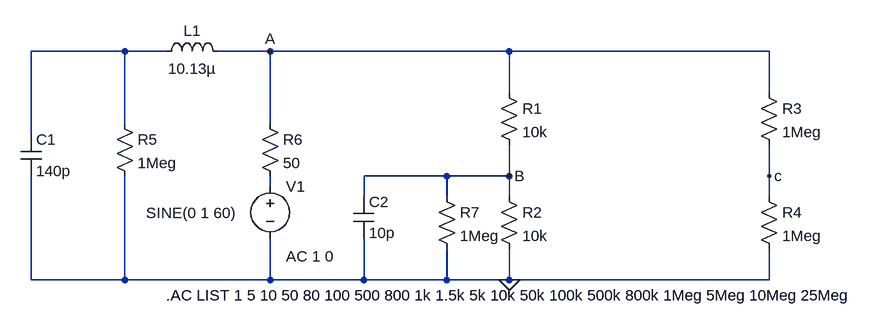
[diagram p0: schematic LAB0_Analoga2_Barridofrecuencias.asc]
LAB0_Analoga2_Barridofrecuencias.asc, the LTspice schematic file:
Version 4
SHEET 1 880 680
WIRE -480 48 -624 48
WIRE -416 48 -480 48
WIRE -256 48 -336 48
WIRE 112 48 -256 48
WIRE 512 48 112 48
WIRE 112 112 112 48
WIRE 512 112 512 48
WIRE -480 160 -480 48
WIRE -256 160 -256 48
WIRE -624 176 -624 48
WIRE 16 240 -112 240
WIRE 112 240 112 192
WIRE 112 240 16 240
WIRE 512 240 512 192
WIRE -256 256 -256 240
WIRE -112 272 -112 240
WIRE 16 272 16 240
WIRE 112 272 112 240
WIRE 512 272 512 240
WIRE -624 400 -624 240
WIRE -480 400 -480 240
WIRE -480 400 -624 400
WIRE -256 400 -256 336
WIRE -256 400 -480 400
WIRE -112 400 -112 336
WIRE -112 400 -256 400
WIRE 16 400 16 352
WIRE 16 400 -112 400
WIRE 112 400 112 352
WIRE 112 400 16 400
WIRE 512 400 512 352
WIRE 512 400 112 400
FLAG 112 400 0
FLAG 112 240 B
FLAG -256 48 A
FLAG 512 240 c
SYMBOL res 96 96 R0
SYMATTR InstName R1
SYMATTR Value 10k
SYMBOL res 96 256 R0
SYMATTR InstName R2
SYMATTR Value 10k
SYMBOL res 496 96 R0
SYMATTR InstName R3
SYMATTR Value 1Meg
SYMBOL res 496 256 R0
SYMATTR InstName R4
SYMATTR Value 1Meg
SYMBOL voltage -256 240 R0
WINDOW 3 -191 57 Left 2
WINDOW 123 24 124 Left 2
WINDOW 39 24 152 Left 2
SYMATTR Value SINE(0 1 60)
SYMATTR Value2 AC 1 0
SYMATTR InstName V1
SYMBOL res -496 144 R0
SYMATTR InstName R5
SYMATTR Value 1Meg
SYMBOL cap -640 176 R0
SYMATTR InstName C1
SYMATTR Value 140p
SYMBOL res -272 144 R0
SYMATTR InstName R6
SYMATTR Value 50
SYMBOL ind -432 64 R270
WINDOW 0 32 56 VTop 2
WINDOW 3 5 56 VBottom 2
SYMATTR InstName L1
SYMATTR Value 10.13µ
SYMBOL cap -128 272 R0
SYMATTR InstName C2
SYMATTR Value 10p
SYMBOL res 0 256 R0
SYMATTR InstName R7
SYMATTR Value 1Meg
TEXT -416 424 Left 2 !.AC LIST 1 5 10 50 80 100 500 800 1k 1.5k 5k 10k 50k 100k 500k 800k 1Meg 5Meg 10Meg 25Meg

The netlist it stands for:
* LAB0_Analoga2_Barridofrecuencias.asc
R1 A B 10k
R2 B 0 10k
R3 A c 1Meg
R4 c 0 1Meg
V1 N002 0 SINE(0 1 60) AC 1 0
R5 N001 0 1Meg
C1 N001 0 140p
R6 A N002 50
L1 N001 A 10.13µ
C2 B 0 10p
R7 B 0 1Meg
.AC LIST 1 5 10 50 80 100 500 800 1k 1.5k 5k 10k 50k 100k 500k 800k 1Meg 5Meg 10Meg 25Meg
.backanno
.end